# EAGLE design pid-dev (EAGLE 5.00)
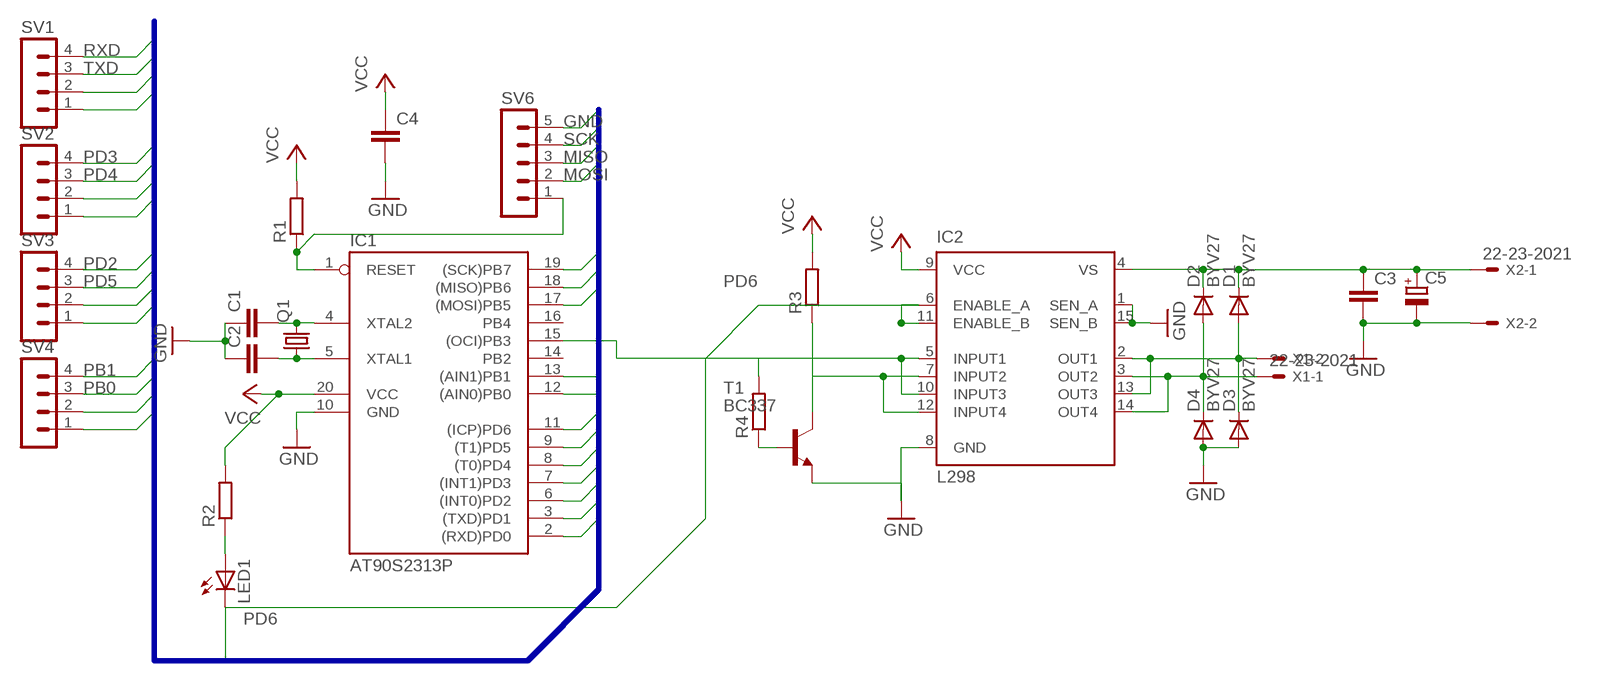
[diagram p0: schematic, sheet 1]

## Parts
C1  C2.5/2  [C2.5-2]
C2  C2.5/2  [C2.5-2]
C3  C5/2.5  [C5B2.5]
C4  C5/2.5  [C5B2.5]
C5  CPOL-EUE5-10.5  [E5-10,5]
D1  BYV27  [SOD57-10]
D2  BYV27  [SOD57-10]
D3  BYV27  [SOD57-10]
D4  BYV27  [SOD57-10]
IC1  AT90S2313P  [DIL20]
IC2  L298  [MULTIWATT-15]
LED1  LED5MM  [LED5MM]
Q1  CRYSTALHC49U70  [HC49U70]
R1  R-EU_0207/10  [0207/10]
R2  R-EU_0207/10  [0207/10]
R3  R-EU_0204/7  [0204/7]
R4  R-EU_0207/2V  [0207/2V]
SV1  MA04-1  [MA04-1]
SV2  MA04-1  [MA04-1]
SV3  MA04-1  [MA04-1]
SV4  MA04-1  [MA04-1]
SV6  MA05-1  [MA05-1]
T1  BC337  [TO92]
X1  22-23-2021  [22-23-2021]
X2  22-23-2021  [22-23-2021]

## Nets
GND: C1.1 C2.1 C3.2 C4.2 C5.- D3.A D4.A IC1.10(GND) IC2.1(SEN_A) IC2.8(GND) IC2.15(SEN_B) SV1.1 SV2.1 SV3.1 SV4.1 SV6.5 T1.1(E) X2.2
MISO: IC1.18((MISO)PB6) SV6.3
MOSI: IC1.17((MOSI)PB5) SV6.2
N$1: IC1.1(RESET) R1.1 SV6.1
N$2: C1.2 IC1.4(XTAL2) Q1.2
N$3: C2.2 IC1.5(XTAL1) Q1.1
N$4: R4.1 T1.2(B)
N$5: D2.A D4.C IC2.3(OUT2) IC2.14(OUT4) X1.1
N$6: LED1.A R2.1
N$7: IC1.15((OCI)PB3) IC2.5(INPUT1) IC2.10(INPUT3) R4.2
N$9: C3.1 C5.+ D1.C D2.C IC2.4(VS) X2.1
N$10: D1.A D3.C IC2.2(OUT1) IC2.13(OUT3) X1.2
N$12: IC2.7(INPUT2) IC2.12(INPUT4) R3.1 T1.3(C)
PB0: IC1.12((AIN0)PB0) SV4.3
PB1: IC1.13((AIN1)PB1) SV4.4
PD2: IC1.6((INT0)PD2) SV3.4
PD3: IC1.7((INT1)PD3) SV2.4
PD4: IC1.8((T0)PD4) SV2.3
PD5: IC1.9((T1)PD5) SV3.3
PD6: IC1.11((ICP)PD6) IC2.6(ENABLE_A) IC2.11(ENABLE_B) LED1.K(C)
RXD: IC1.3((TXD)PD1) SV1.4
SCK: IC1.19((SCK)PB7) SV6.4
TXD: IC1.2((RXD)PD0) SV1.3
VCC: C4.1 IC1.20(VCC) IC2.9(VCC) R1.2 R2.2 R3.2 SV1.2 SV2.2 SV3.2 SV4.2
Unconnected: IC1.14(PB2) IC1.16(PB4)

## Buses
PD[0..6],PB[0..7],SCK,MISO,MOSI,RXD,TXD,GND,VCC

## Library data of the parts
C1-C4 = capacitor-wima:C: CAPACITOR naming: grid - package width
C5 = rcl:CPOL-EU: POLARIZED CAPACITOR, European symbol
D1-D4 = diode:BYV27: DIODE ultra fast
IC1 = atmel:AT90S2313: MICROCONTROLLER 2 Kbytes FLASH 128 bytes SRAM 128 bytes EEPROM UART
IC2 = st-microelectronics:L298: DUAL FULL-BRIDGE DRIVER
LED1 = led:LED: LED OSRAM: - CHIPLED LG R971, LG N971, LY N971, LG Q971, LY Q971, LO R971, LY R971 LH N974, LH R974 LS Q976, LO Q976, LY Q976 LO Q996 - Hyper CHIPLED LW Q18S LB Q993, LB Q99A, LB R99A - SideLED LS A670, LO A670, LY A670, LG A670, LP A670 LB A673, LV A673, LT A673, LW A673 LH A674 LY A675 LS A676, LA A676, LO A676, LY A676, LW A676 LS A679, LY A679, LG A679 - Hyper Micro SIDELED® LS Y876, LA Y876, LO Y876, LY Y876 LT Y87S - SmartLED LW L88C, LW L88S LB L89C, LB L89S, LG L890 LS L89K, LO L89K, LY L89K LS L896, LA L896, LO L896, LY L896 - TOPLED LS T670, LO T670, LY T670, LG T670, LP T670 LSG T670, LSP T670, LSY T670, LOP T670, LYG T670 LG T671, LOG T671, LSG T671 LB T673, LV T673, LT T673, LW T673 LH T674 LS T676, LA T676, LO T676, LY T676, LB T676, LH T676, LSB T676, LW T676 LB T67C, LV T67C, LT T67C, LS T67K, LO T67K, LY T67K, LW E67C LS E67B, LA E67B, LO E67B, LY E67B, LB E67C, LV E67C, LT E67C LW T67C LS T679, LY T679, LG T679 LS T770, LO T770, LY T770, LG T770, LP T770 LB T773, LV T773, LT T773, LW T773 LH T774 LS E675, LA E675, LY E675, LS T675 LS T776, LA T776, LO T776, LY T776, LB T776 LHGB T686 LT T68C, LB T68C - Hyper Mini TOPLED® LB M676 - Mini TOPLED Santana® LG M470 LS M47K, LO M47K, LY M47K Source: http://www.osram.convergy.de - LUMILED® LXK2-PW12-R00, LXK2-PW12-S00, LXK2-PW14-U00, LXK2-PW14-V00 LXK2-PM12-R00, LXK2-PM12-S00, LXK2-PM14-U00 LXK2-PE12-Q00, LXK2-PE12-R00, LXK2-PE12-S00, LXK2-PE14-T00, LXK2-PE14-U00 LXK2-PB12-K00, LXK2-PB12-L00, LXK2-PB12-M00, LXK2-PB14-N00, LXK2-PB14-P00, LXK2-PB14-Q00 LXK2-PR12-L00, LXK2-PR12-M00, LXK2-PR14-Q00, LXK2-PR14-R00 LXK2-PD12-Q00, LXK2-PD12-R00, LXK2-PD12-S00 LXK2-PH12-R00, LXK2-PH12-S00 LXK2-PL12-P00, LXK2-PL12-Q00, LXK2-PL12-R00 Source: www.luxeon.com
Q1 = crystal:CRYSTAL: CRYSTAL
R1 R3 = resistor:R-EU_: RESISTOR, European symbol
R2 R4 = rcl:R-EU_: RESISTOR, European symbol
SV1-SV4 = con-lstb:MA04-1: PIN HEADER
SV6 = con-lstb:MA05-1: PIN HEADER
T1 = transistor:BC337: NPN TRANSISTOR
X1 X2 = con-molex:22-23-2021: .100" (2.54mm) Center Header - 2 Pin

## Board
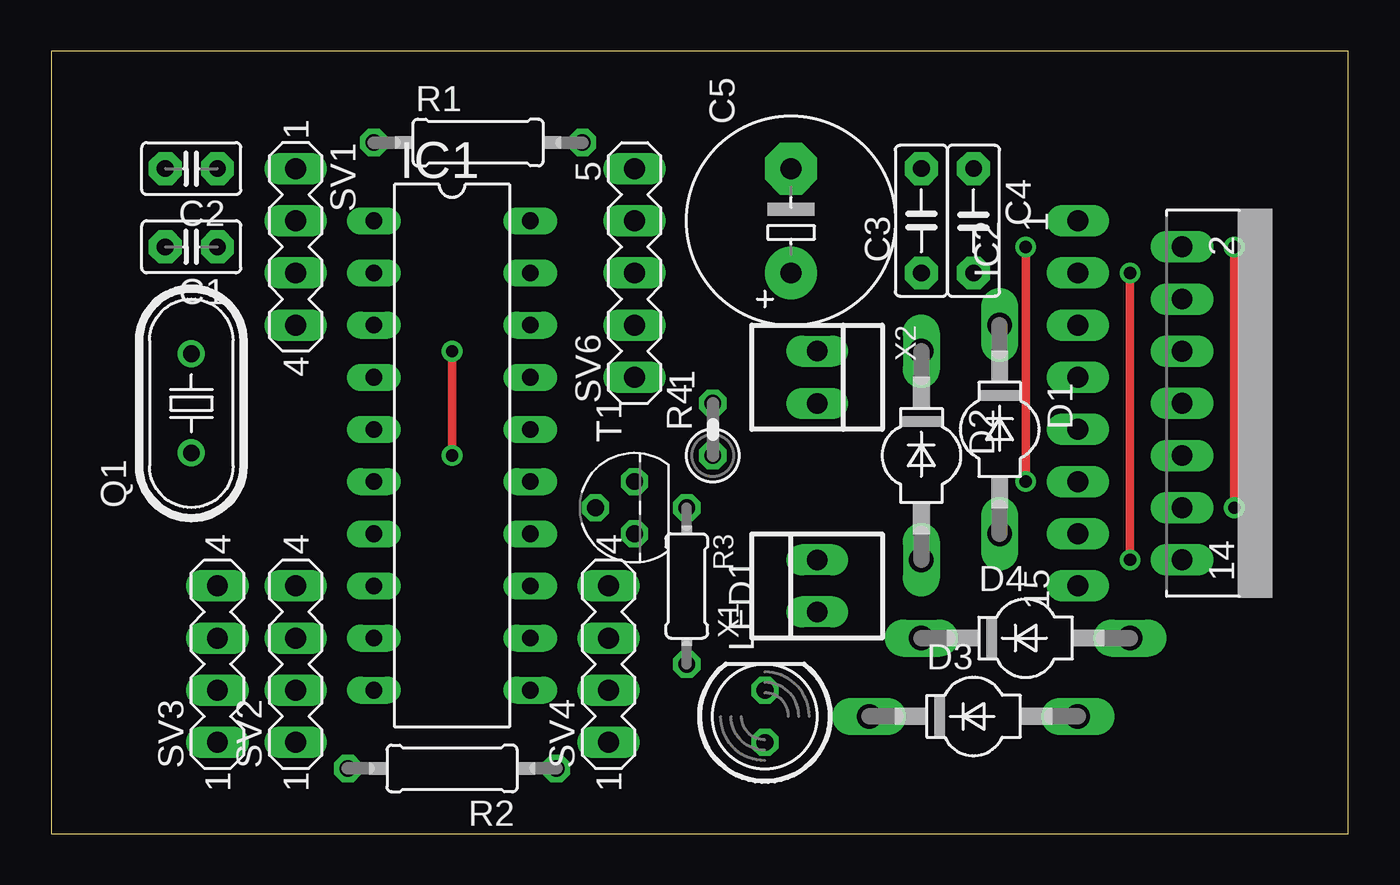
[diagram p1: board, top side]
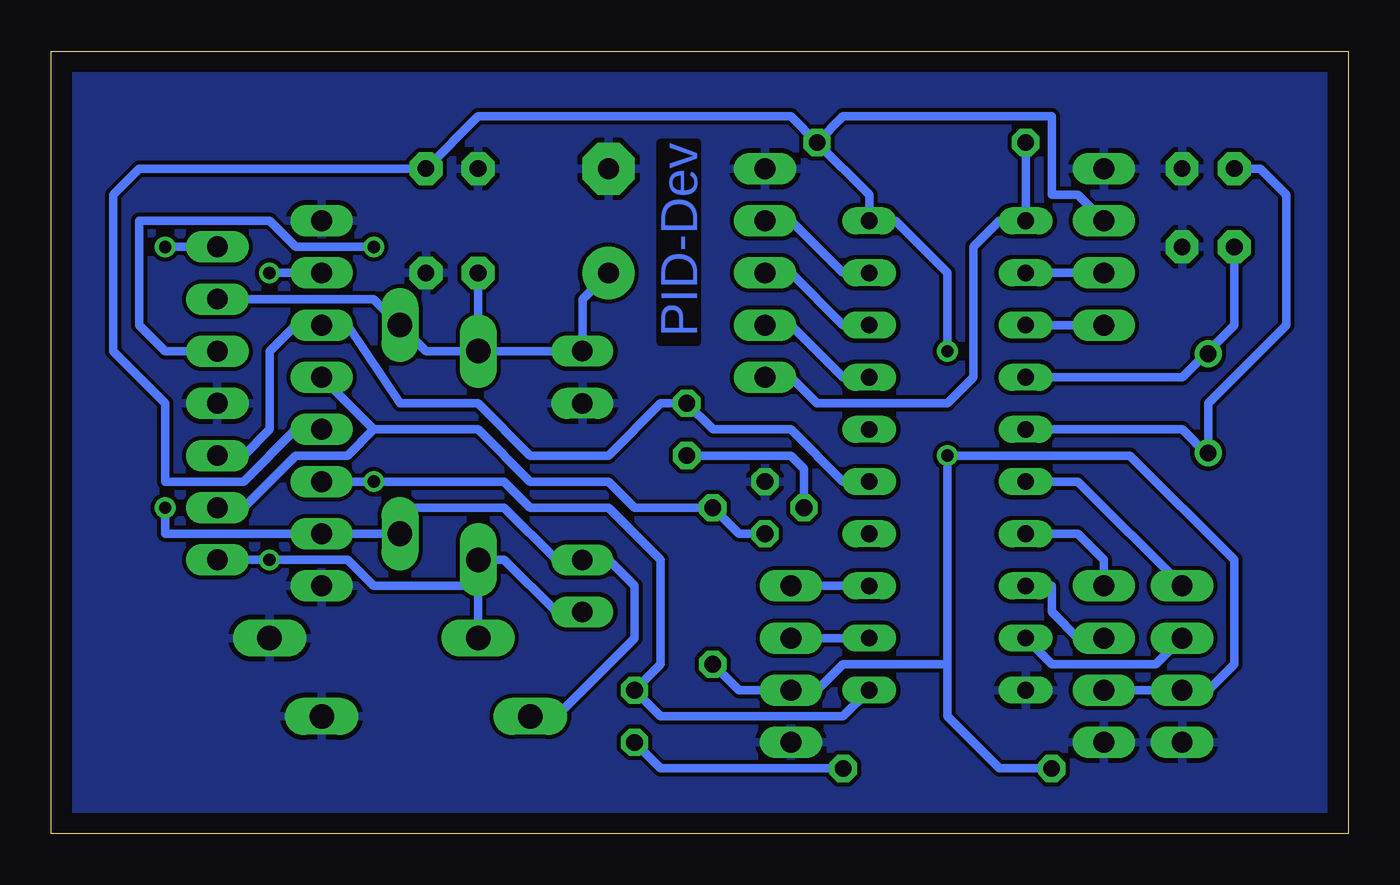
[diagram p2: board, bottom side, seen from below]

Size 63.17 x 38.09 mm. Coordinates in mm from the lower left corner, seen from the top.
Outline: 0,0 63.17,0 63.17,38.09 0,38.09 0,0
Copper layers (1*16): Top 0.035mm / dielectric 1.5mm / Bottom 0.035mm
Design rules "default": minimum track width 10mil, minimum drill 24mil, track to track 8mil, track to pad 8mil, pad to pad 8mil, via to via 8mil, smd to smd 8mil, copper to edge 40mil, drill to drill 8mil, minimum pad ring 10mil, minimum via ring 8mil, stop-mask expansion 4mil, vias tented up to drill 0mil, thermal gap 10mil

### Footprints (pad centres in the part's own frame; a part is rotated, then mirrored left to right if it is on the bottom)
C2.5-2 = drill 0.813 pad 1.6 octagon: 1 -1.27,0; 2 1.27,0
C5B2.5 = drill 0.813 pad 1.6 octagon: 1 -2.54,0; 2 2.54,0
E5-10,5 = drill 1.016 pad 2.54 round: + -2.54,0 | drill 1.016 pad 2.54 octagon: - 2.54,0
SOD57-10 = drill 1.194 long: A 5.08,0; C -5.08,0
DIL20 = drill 0.813 long: 1 -11.43,-3.81; 2 -8.89,-3.81; 3 -6.35,-3.81; 4 -3.81,-3.81; 5 -1.27,-3.81; 6 1.27,-3.81; 7 3.81,-3.81; 8 6.35,-3.81; 9 8.89,-3.81; 10 11.43,-3.81; 11 11.43,3.81; 12 8.89,3.81; 13 6.35,3.81; 14 3.81,3.81; 15 1.27,3.81; 16 -1.27,3.81; 17 -3.81,3.81; 18 -6.35,3.81; 19 -8.89,3.81; 20 -11.43,3.81
MULTIWATT-15 = drill 1.016 long: 1 -8.89,-7.62; 2 -7.62,-2.54; 3 -6.35,-7.62; 4 -5.08,-2.54; 5 -3.81,-7.62; 6 -2.54,-2.54; 7 -1.27,-7.62; 8 0,-2.54; 9 1.27,-7.62; 10 2.54,-2.54; 11 3.81,-7.62; 12 5.08,-2.54; 13 6.35,-7.62; 14 7.62,-2.54; 15 8.89,-7.62
LED5MM = drill 0.813 octagon: A -1.27,0; K 1.27,0
HC49U70 = drill 0.813 round: 1 -2.413,0; 2 2.413,0
0207/10 = drill 0.813 octagon: 1 -5.08,0; 2 5.08,0
0204/7 = drill 0.813 octagon: 1 -3.81,0; 2 3.81,0
0207/2V = drill 0.813 octagon: 1 -1.27,0; 2 1.27,0
MA04-1 = drill 1.016 long: 1 -3.81,0; 2 -1.27,0; 3 1.27,0; 4 3.81,0
MA05-1 = drill 1.016 long: 1 -5.08,0; 2 -2.54,0; 3 0,0; 4 2.54,0; 5 5.08,0
TO92 = drill 0.813 octagon: 1 1.27,0; 2 0,1.905; 3 -1.27,0
22-23-2021 = drill 1 long: 1 -1.27,0; 2 1.27,0

### Placement (x,y rotation side)
C1  6.82,28.57 180 top
C2  6.82,32.38 180 top
C3  42.38,29.84 90 top
C4  44.92,29.84 270 top
C5  36.03,29.84 90 top
D1  46.19,19.68 270 top
D2  42.38,18.41 270 top
D3  44.92,5.71 0 top
D4  47.46,9.52 0 top
IC1  19.52,18.41 270 top
IC2  57.62,20.95 270 top
LED1  34.76,5.71 90 top
Q1  6.82,20.95 90 top
R1  20.79,33.65 0 top
R2  19.52,3.17 180 top
R3  30.95,12.06 270 top
R4  32.22,19.68 90 top
SV1  11.9,28.57 270 top
SV2  11.9,8.25 90 top
SV3  8.09,8.25 90 top
SV4  27.14,8.25 90 top
SV6  28.41,27.3 90 top
T1  28.41,15.87 90 top
X1  37.3,12.06 90 top
X2  37.3,22.22 270 top

### Tracks (layer width: path | path; a pad name or v marks a point on that pad's centre or on a via)
GND
  pour Bottom: -0.8,-0.64 -0.8,38.73 63.97,38.73 63.97,-0.64
MISO
  Bottom 0.406: SV6.3 27.14,27.3 24.6,24.76 IC1.18
MOSI
  Bottom 0.406: IC1.17 24.6,22.22 27.14,24.76 SV6.2
N$1
  Bottom 0.406: R1.1 IC1.1 16.98,29.84 18.25,28.57 18.25,22.22 19.52,20.95 25.87,20.95 27.14,22.22 SV6.1
N$2
  Bottom 0.406: IC1.4 8.09,22.22 6.82,23.49 | Q1.2 6.82,23.49 | 6.82,23.49 5.55,24.76 C1.2
N$3
  Bottom 0.406: IC1.5 8.09,19.68 6.82,18.41 Q1.1 6.82,20.95 3.01,24.76 3.01,31.11 4.28,32.38 C2.2
N$4
  Bottom 0.406: T1.2 26.5,17.77 27.14,18.41 R4.1
N$5  (via drill 0.6)
  Top 0.406: v52.54,13.33 v52.54,27.3
  Bottom 0.406: v52.54,27.3 IC2.3 | IC2.14 v52.54,13.33 48.73,13.33 47.46,12.06 42.38,12.06 D2.A | X1.1 38.57,10.79 41.11,13.33 D2.A | D2.A D4.C
N$6
  Bottom 0.406: LED1.A 33.49,3.17 R2.1
N$7
  Bottom 0.406: IC2.10 53.81,18.41 52.54,19.68 52.54,23.49 51.27,24.76 IC2.5 48.73,24.76 46.19,20.95 42.38,20.95 39.84,18.41 36.03,18.41 33.49,20.95 R4.2 30.95,19.68 27.14,19.68 24.6,17.14 IC1.15
N$9
  Bottom 0.406: C5.+ 37.3,26.03 X2.1 D2.C | IC2.4 47.46,26.03 D1.C 44.92,23.49 D2.C | D2.C C3.1
N$10  (via drill 0.6)
  Top 0.406: v57.62,15.87 v57.62,28.57
  Bottom 0.406: v57.62,28.57 IC2.2 | v57.62,15.87 57.62,14.6 IC2.13 D1.A 46.19,15.87 41.11,15.87 38.57,13.33 X1.2 36.03,13.33 34.76,12.06 34.76,9.52 38.57,5.71 D3.C
N$12
  Bottom 0.406: IC2.12 53.81,15.87 51.27,18.41 48.73,18.41 47.46,19.68 | 47.46,19.68 IC2.7 | 47.46,19.68 42.38,19.68 39.84,17.14 36.03,17.14 34.76,15.87 R3.1 29.68,14.6 T1.3
PB0
  Bottom 0.406: IC1.12 SV4.3
PB1
  Bottom 0.406: IC1.13 SV4.4
PD2
  Bottom 0.406: SV3.4 13.17,17.14 IC1.6
PD3
  Bottom 0.406: SV2.4 11.9,13.33 13.17,14.6 IC1.7
PD4
  Bottom 0.406: SV2.3 13.17,9.52 14.44,10.79 14.44,12.06 IC1.8
PD5
  Bottom 0.406: SV3.3 9.36,8.25 14.44,8.25 IC1.9
PD6  (via drill 0.6)
  Top 0.406: v47.46,17.14 v47.46,28.57
  Bottom 0.406: IC1.11 24.6,5.71 33.49,5.71 LED1.K 33.49,8.25 33.49,13.33 36.03,15.87 39.84,15.87 41.11,17.14 v47.46,17.14 IC2.11 | IC2.6 57.62,23.49 58.89,24.76 58.89,29.84 52.54,29.84 51.27,28.57 v47.46,28.57
RXD
  Bottom 0.406: SV1.4 IC1.3
SCK
  Bottom 0.406: IC1.19 24.6,27.3 27.14,29.84 SV6.4
TXD
  Bottom 0.406: SV1.3 IC1.2
VCC  (via drill 0.6)
  Top 0.406: v19.52,18.41 v19.52,23.49
  Bottom 0.406: R1.2 27.14,34.92 42.38,34.92 C4.1 58.89,32.38 60.16,31.11 60.16,23.49 57.62,20.95 57.62,17.14 53.81,17.14 51.27,19.68 IC2.9 | SV1.2 13.17,31.11 14.44,31.11 14.44,34.92 24.6,34.92 R1.2 | SV3.2 SV2.2 6.82,6.98 5.55,8.25 5.55,13.33 10.63,18.41 v19.52,18.41 19.52,8.25 | 19.52,8.25 24.6,8.25 25.87,6.98 SV4.2 29.68,6.98 R3.2 | R1.2 23.33,31.11 IC1.20 22.06,29.84 19.52,27.3 v19.52,23.49 | R2.2 16.98,3.17 19.52,5.71 19.52,8.25

### Text on the board
Bottom: PID-Dev